# Altium project CANSwitch_V2.PrjPcb
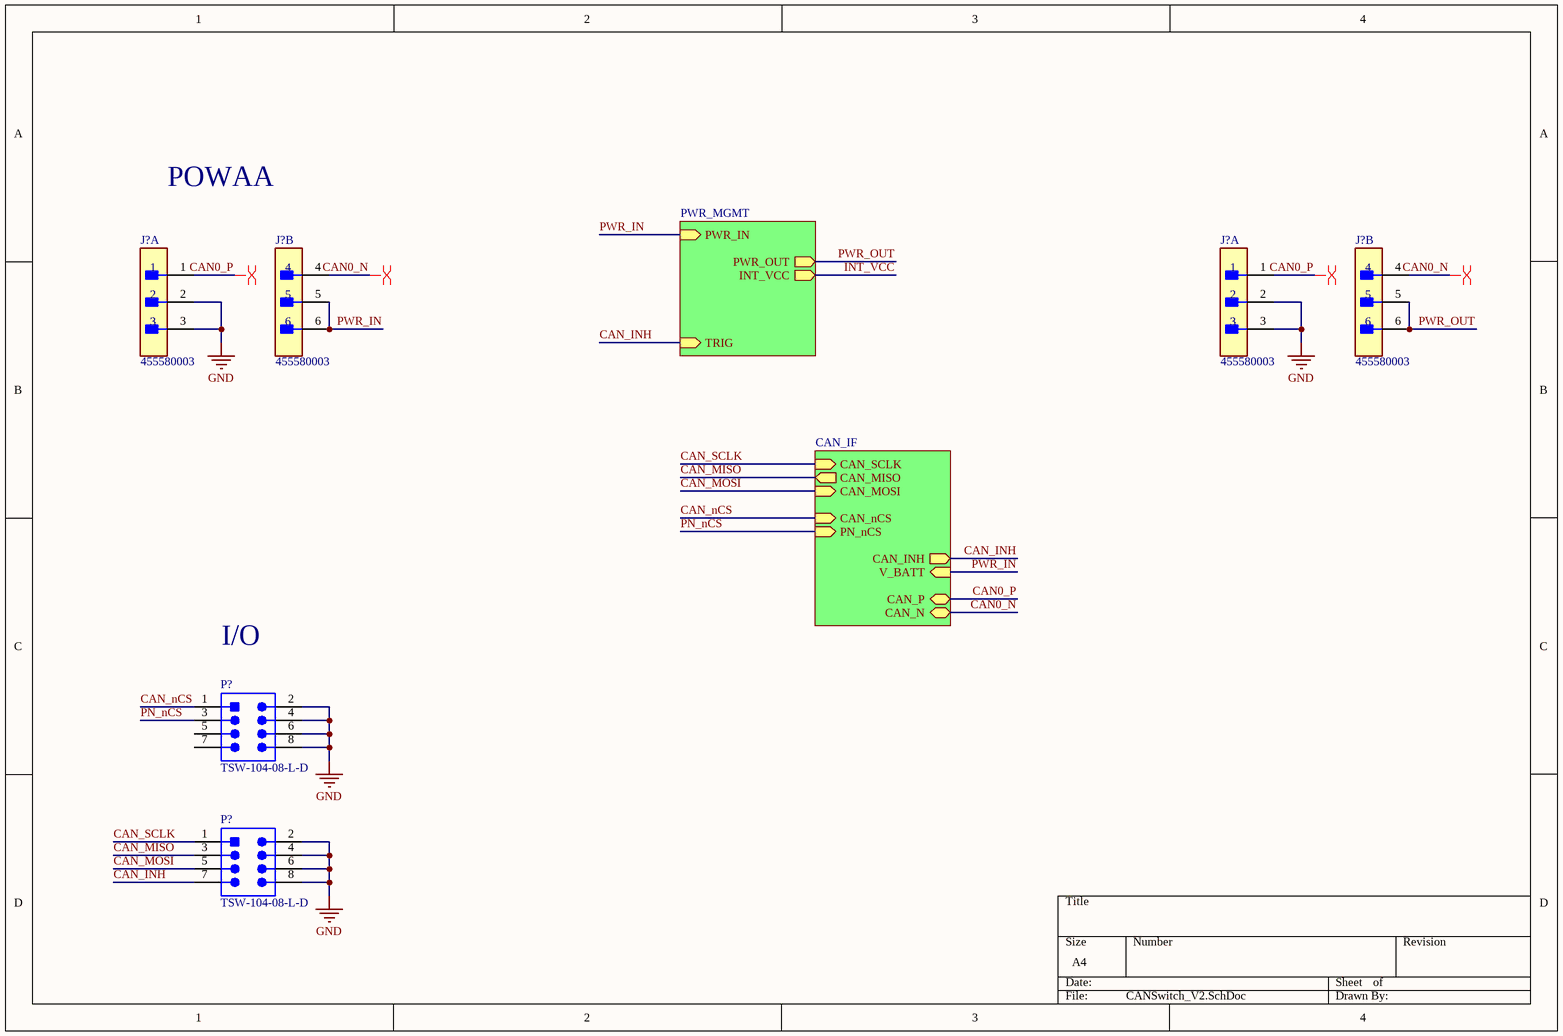
[diagram p0: CANSwitch_V2.SchDoc]
2 sheets, 24 parts. Net scope: hierarchical (ports join the sheet entries above them; power ports are global).
Sheets:
  CANSwitch_V2.SchDoc
    CAN_0 = CAN_IF.SchDoc

## Sheet CANSwitch_V2.SchDoc
size A4; SheetNumber: 1; SheetTotal: 3

### Parts
(Parts that share a designator on the sheet are numbered #1, #2 ... from top to bottom, then left to right.)
J?#1  455580003  [FP-455580003-MFG]  (part A of 2)
J?#2  455580003  [FP-455580003-MFG]  (part B of 2)
J?#3  455580003  [FP-455580003-MFG]  (part A of 2)
J?#4  455580003  [FP-455580003-MFG]  (part B of 2)
P?#1  TSW-104-08-L-D  [SMTC-TSW-104-08-L-D_V]
P?#2  TSW-104-08-L-D  [SMTC-TSW-104-08-L-D_V]

### Sub-sheets
CAN_0 = CAN_IF: CAN_SCLK (in), CAN_MISO (out), CAN_MOSI (in), CAN_nCS (in), CAN_INH (out), V_BATT (in), CAN_P (bidir), CAN_N (bidir), PN_nCS (in)
PWR_MGMT = PWR_MGMT (file not in this document): TRIG (in), PWR_OUT (out), PWR_IN (in), INT_VCC (out)

### Nets
GND: J?#1.2 J?#1.3 J?#3.2 J?#3.3 P?#1.2 P?#1.4 P?#1.6 P?#1.8 P?#2.2 P?#2.4 P?#2.6 P?#2.8
CAN0_N: J?#2.4 J?#4.4 ; sheet CAN_0/CAN_N
CAN0_P: J?#1.1 J?#3.1 ; sheet CAN_0/CAN_P
CAN_INH: P?#2.7 ; sheet CAN_0/CAN_INH, sheet PWR_MGMT/TRIG
CAN_MISO: P?#2.3 ; sheet CAN_0/CAN_MISO
CAN_MOSI: P?#2.5 ; sheet CAN_0/CAN_MOSI
CAN_nCS: P?#1.1 ; sheet CAN_0/CAN_nCS
CAN_SCLK: P?#2.1 ; sheet CAN_0/CAN_SCLK
INT_VCC: sheet PWR_MGMT/INT_VCC
PN_nCS: P?#1.3 ; sheet CAN_0/PN_nCS
PWR_IN: J?#2.5 J?#2.6 ; sheet CAN_0/V_BATT, sheet PWR_MGMT/PWR_IN
PWR_OUT: J?#4.5 J?#4.6 ; sheet PWR_MGMT/PWR_OUT

Not connected (* = marked no-connect by the designer): P?#1 5 7

### Layout directives
differential pair: CAN0_N, CAN0_P

### Notes on the sheet
- POWAA
- I/O

### Library data of the parts
J?#1-J?#4 = CMP-04776-000024-1: CONN HEADER R/A 6POS 4.2MM; Manufacturer: Molex; Standoff Height: 0.4mm; Conn Orientation: Right Angle; Number Of Contacts: 6; Conn Gender: Male; Voltage Rating: 600V; Current Rating: 8A; Footprint Url: https://www.molex.com/pdm_docs/sd/455580003_sd.pdf; Number Of Rows: 2; Lead Free: Yes; Digikey Description: CONN HEADER R/A 6POS 4.2MM; ComponentLink2URL: https://www.molex.com/webdocs/datasheets/pdf/en-us/0455580003_PCB_HEADERS.pdf; Octopart: https://octopart.com/45558-0003-molex-7672845; Package: 0; Device Class L3: unset; ComponentLink2Description: Datasheet; Device Class L2: Headers and Wire Housings; Category: Conn; Contact Material: Tin,Nickel; Mouser Description: Conn Power HDR 6 POS 4.2mm Solder ST Thru-Hole 6 Terminal 1 Port Mini-Fit Jr™ Tray; Manufacturer Part Number: 455580003; Pitch: 4.2mm; Device Class L1: Connectors; Temperature Range Low: -40°C; Temperature: -40°C to +105°C; RoHS: TRUE; Temperature Range High: +105°C; Height: 10.38mm; Automotive: No
P?#1 P?#2 = CMP-1681-00006-4: Male Header, Pitch 2.54 mm, 2 x 4 Position, Height 8.38 mm, Tail Length 5.08 mm, -55 to 125 degC, RoHS, Bulk; Manufacturer: Samtec; Voltage Rating: 550 V; Current Rating: 7.6 A; Rows: 2; ComponentLink2URL: https://datasheet.ciiva.com/25616/0900766b81154476-25616879.pdf; Package Quantity: 1; PackageDescription: Male Header, Pitch 2.54 mm, 2 x 4 Position, Height 8.38 mm, Tail Length 5.08 mm; ComponentLink1Description: Manufacturer URL; Lead Pitch: 0.1 inch; REACH SVHC: No SVHC; Mounting Technology: Through Hole; PackageReference: TSW-104-08-L-D; Contact Plating: Gold; DatasheetVersion: 04/2012; Colour: Black; Contact Finish: Gold; ComponentLink3URL: http://suddendocs.samtec.com/prints/tsw-xxx-xx-x-x-xx-xxx-footprint.pdf; ComponentLink3Description: Package Specification; Mount: Through Hole; RoHSCompliant: true; Packaging: Bulk; ComponentLink2Description: Datasheet; Contact Material: Bronze; Pins: 8; ComponentLink1URL: http://www.samtec.com/

## Sheet CAN_IF.SchDoc
size B; SheetNumber: 2; SheetTotal: 3
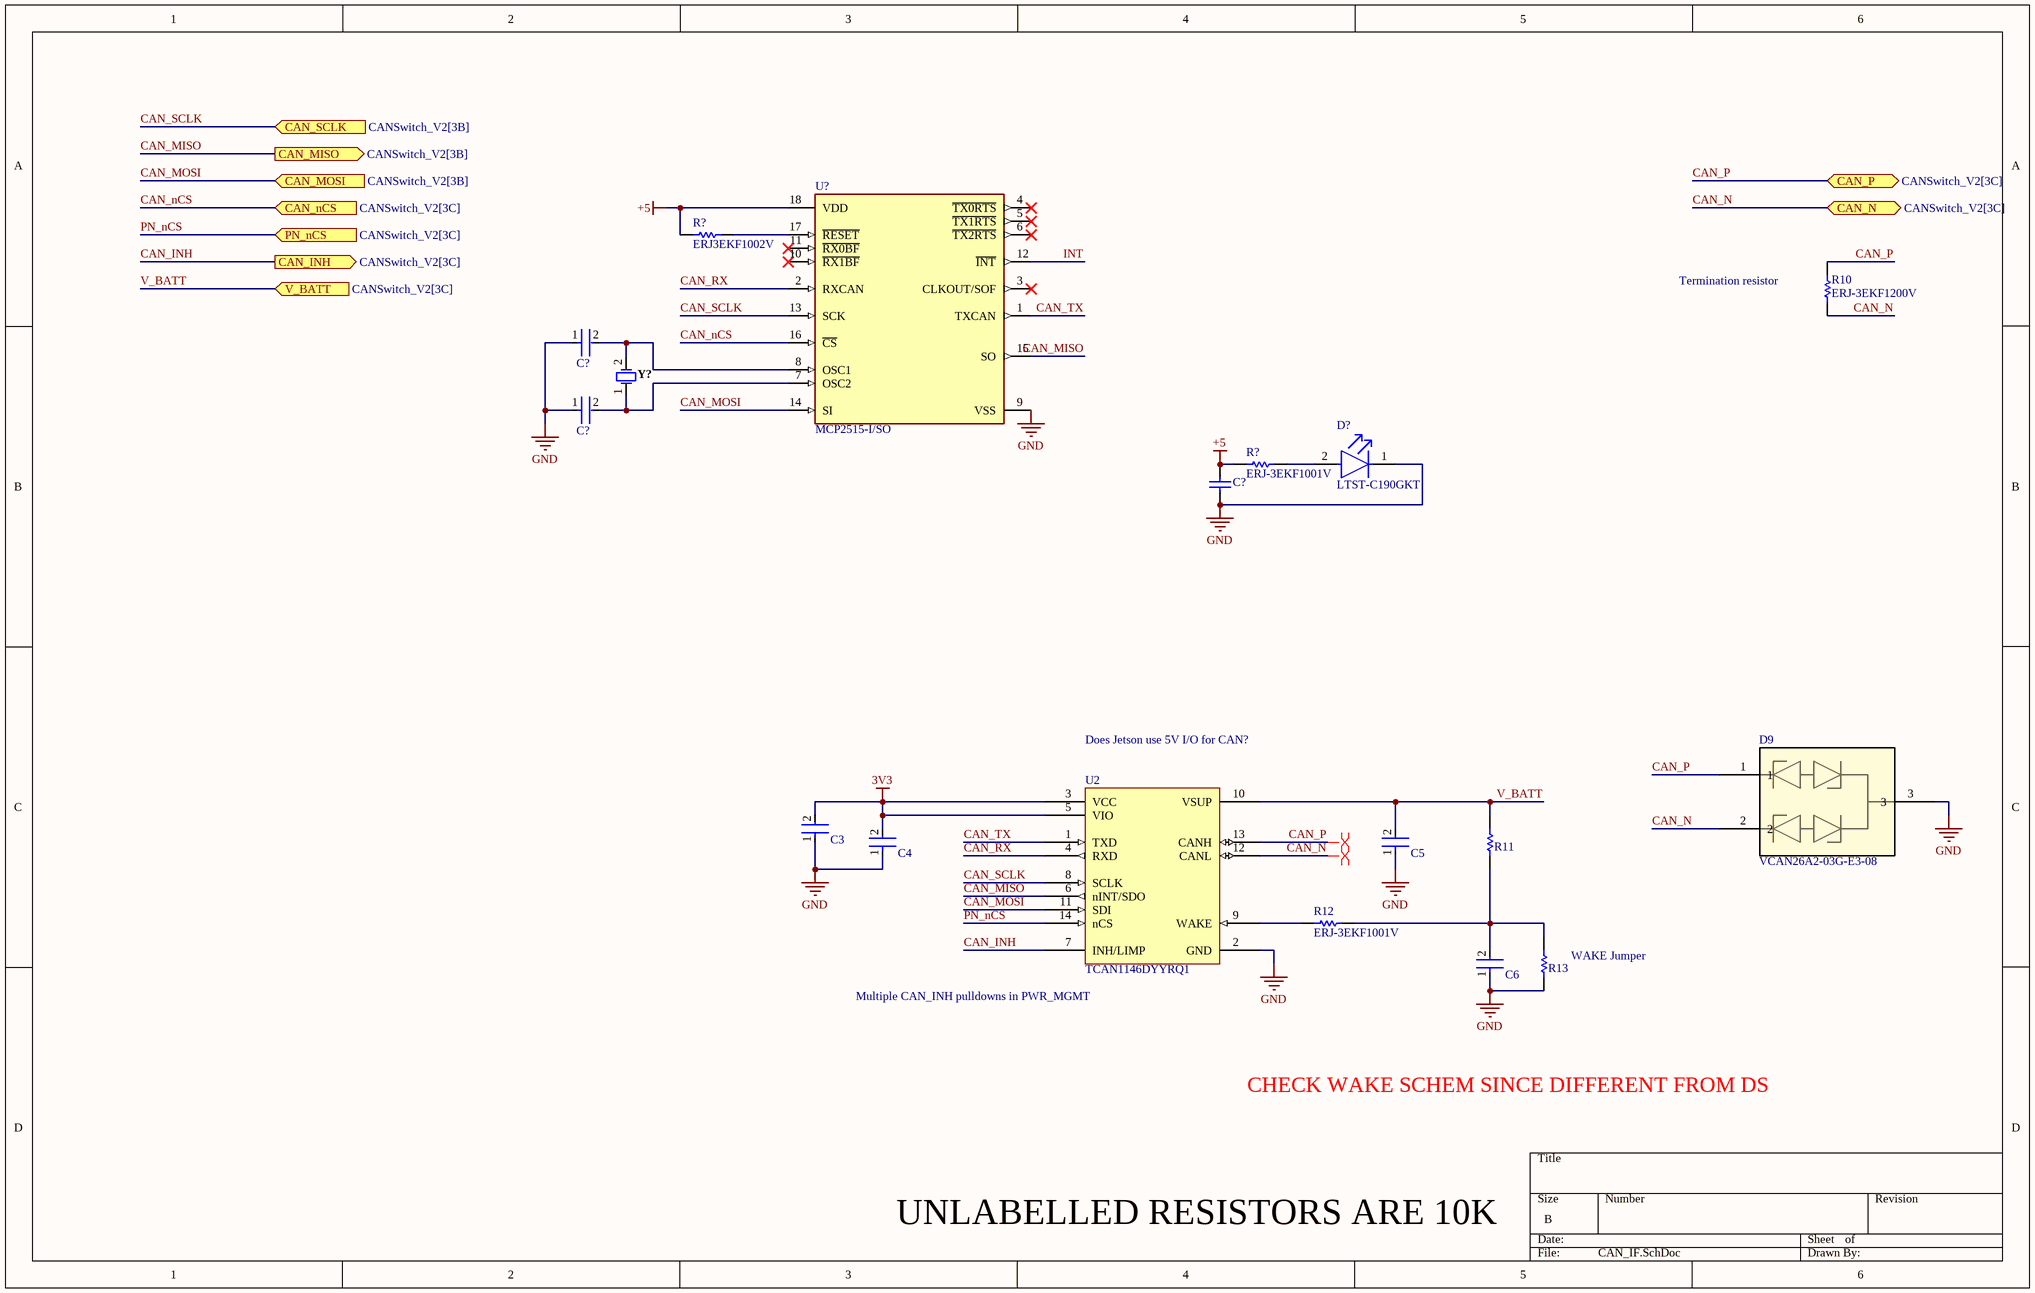
[diagram p1: CAN_IF.SchDoc]

### Parts
(Parts that share a designator on the sheet are numbered #1, #2 ... from top to bottom, then left to right.)
C3  C0402C104K8PACTU  [FP-C0402-BB-MFG]  (value not drawn)
C4  C0402C104K8PACTU  [FP-C0402-BB-MFG]  (value not drawn)
C5  C0402C104K8PACTU  [FP-C0402-BB-MFG]  (value not drawn)
C6  C0402C104K8PACTU  [FP-C0402-BB-MFG]  (value not drawn)
C?#1  GRM188R60J106ME47D  [FP-GRM188-0_1-e0_2_0_55-IPC_A]  (value not drawn)
C?#2  GRM188R60J106ME47D  [FP-GRM188-0_1-e0_2_0_55-IPC_A]  (value not drawn)
C?#3  1206GC102KAT1A  [AVX-1206-2_L]  (value not drawn)
D9  VCAN26A2-03G-E3-08  [VCAN26A2-03G-E3-08-Footprint-1]
D?  LTST-C190GKT  [FP-LTST-C190GKT-MFG]
R10  ERJ-3EKF1200V  [RESC1609X55X30ML15T15]
R11  ERJ3EKF1002V  [RESC1609X55X30LL15T15]  (value not drawn)
R12  ERJ-3EKF1001V  [RESC1608X55X30LL15T15]
R13  0402 JUMPER 0 OHM  [RESC1005X40X25NL05T05]  (value not drawn)
R?#1  ERJ3EKF1002V  [RESC1609X55X30LL15T15]
R?#2  ERJ-3EKF1001V  [RESC1608X55X30LL15T15]
U2  TCAN1146DYYRQ1  [TCAN1146DYYRQ1-Footprint-1]
U?  MCP2515-I/SO  [FP-C04-051-MFG]
Y?  FOXSLF/160-20  [FOX-FOXSLF160-20]  (value not drawn)

### Ports
CAN_INH (out, see CANSwitch_V2[3C]), CAN_MISO (out, see CANSwitch_V2[3B]), CAN_MOSI (in, see CANSwitch_V2[3B]), CAN_N (bidir, see CANSwitch_V2[3C]), CAN_nCS (in, see CANSwitch_V2[3C]), CAN_P (bidir, see CANSwitch_V2[3C]), CAN_SCLK (in, see CANSwitch_V2[3B]), PN_nCS (in, see CANSwitch_V2[3C]), V_BATT (in, see CANSwitch_V2[3C])

### Nets
3V3: C3.2 C4.2 U2.3(VCC) U2.5(VIO)
+5: C?#3.2 R?#1.1 R?#2.2 U?.18(VDD)
GND: C3.1 C4.1 C5.1 C6.1 C?#1.1 C?#2.1 C?#3.1 D9.3 D?.1(C) R13.1 U2.2(GND) U?.9(VSS)
CAN_INH: U2.7(INH/LIMP) ; port CAN_INH
CAN_MISO: U2.6(nINT/SDO) U?.15(SO) ; port CAN_MISO
CAN_MOSI: U2.11(SDI) U?.14(SI) ; port CAN_MOSI
CAN_N: D9.2 R10.1 U2.12(CANL) ; port CAN_N  [project net CAN0_N]
CAN_nCS: U?.16(~{CS}) ; port CAN_nCS
CAN_P: D9.1 R10.2 U2.13(CANH) ; port CAN_P  [project net CAN0_P]
CAN_RX: U2.4(RXD) U?.2(RXCAN)
CAN_SCLK: U2.8(SCLK) U?.13(SCK) ; port CAN_SCLK
CAN_TX: U2.1(TXD) U?.1(TXCAN)
INT: U?.12(~{INT})
PN_nCS: U2.14(nCS) ; port PN_nCS
V_BATT: C5.2 R11.1 U2.10(VSUP) ; port V_BATT  [project net PWR_IN]
NetC6_2: C6.2 R11.2 R12.2 R13.2
NetC?#1_2: C?#1.2 U?.8(OSC1) Y?.2
NetC?#2_2: C?#2.2 U?.7(OSC2) Y?.1
NetD?_2: D?.2(A) R?#2.1
NetR12_1: R12.1 U2.9(WAKE)
NetR?#1_2: R?#1.2 U?.17(~{RESET})

Not connected (* = marked no-connect by the designer): U? 3(CLKOUT/SOF)* 4(~{TX0RTS})* 5(~{TX1RTS})* 6(~{TX2RTS})* 10(~{RX1BF})* 11(~{RX0BF})*

### Layout directives
differential pair: CAN0_N, CAN0_P

### Notes on the sheet
- (near R10) Termination resistor
- Does Jetson use 5V I/O for CAN?
- (near R13) WAKE Jumper
- (near U2) Multiple CAN_INH pulldowns in PWR_MGMT
- CHECK WAKE SCHEM SINCE DIFFERENT FROM DS
- UNLABELLED RESISTORS ARE 10K

### Library data of the parts
C3-C6 = CMP-2008-02046-2: CAP CER 0.1UF 10V X5R 0402; Manufacturer: Kemet; Material: Ceramic; Capacitance: 0.10 μF; Temperature Coefficient: 15%; Tolerance: 0.1; Value: 0.10 μF; Package: C0402-BB; Temperature: -55°C to +125°C; ComponentLink2Description: Datasheet; Temperature Characteristic: X5R; Device Class L1: Passive Components; Height: 0.55mm; Lead Free: Yes; ComponentLink2URL: https://content.kemet.com/datasheets/KEM_C1002_X7R_SMD.pdf; Device Class L2: Capacitors; Temperature Range Low: -55°C; Temperature Range High: +125°C; RoHS: TRUE; Octopart: https://octopart.com/c0402c104k8pactu-kemet-140039; Automotive: No; Mouser Description: Capacitor 100 nF 10 VDC 0402; Category: Cap; Voltage Rating: 10 V; Digikey Description: CAP CER 0.1UF 10V X5R 0402; Ipc Land Pattern Name: CAPC10050X50; Device Class L3: Ceramic Capacitors; Manufacturer Part Number: C0402C104K8PACTU
C?#1 C?#2 = CMP-2006-02792-2: Chip Multilayer Ceramic Capacitors for General Purpose, 0603, 10uF, X5R, 15%, 20%, 6.3V; Packaging: Tape and Reel; Voltage Rating (DC): 6.3V; Width: 0.031inch; Termination: SMD/SMT; Dielectric: X5R; Package Quantity: 4000; Voltage Rating: 6.3V; Capacitance: 10uF; Case/Package: 0603; Min Operating Temperature: -55°C; Voltage: 6.3V; Length: 1.6mm; Thickness: 0.035inch; Lead Free: Lead Free; Depth: 0.8mm; Case Code (Imperial): 0603; Max Operating Temperature: 85°C; Material: Ceramic; Height: 0.8mm; Tolerance: 20%; Mount: Surface Mount; REACH SVHC: No SVHC; Radiation Hardening: No; Case Code (Metric): 1608
C?#3 = CMP-2000-05468-1: Chip Capacitor, 1 nF, +/- 10%, -55 to 125 degC, 1206 (3216 Metric), RoHS, Tape and Reel; Manufacturer: AVX; Capacitance: 0.001uF; Dielectric: X7R; Voltage Rating DC: 2000V; Package Reference: 1206; Datasheet Version: 11/2010; Mounting Technology: SurfaceMount; Manufacturer URL: http://www.avx.com/; Tolerance: 10%; Tolerance (%): ±10%; PartNumber: 1206GC102KAT1A; Datasheet URL: https://datasheet.ciiva.com/11787/0900766b80ed4c37-11787781.pdf; Package Description: 2-Pin SMD, Body 3.4 x 1.8 mm; Case Size/Dimension: 1206; Rated Voltage: 2000V
D9 = CMP-004-00042-1: ESD Suppressor Diode TVS Bi-Dir 26.5V 3-Pin SOT-323 T/R
D? = CMP-22017-000005-2: LED GREEN CLEAR CHIP SMD; Dominant Wavelength: 569nm; Reverse Voltage: 5V; Lens Color: Colorless; Viewing Angle: 130°; Voltage: 2V; Forward Current: 30mA; Power Dissipation: 100mW; Luminous Intensity: 6mcd; Number of LEDs: 1; Forward Voltage: 2.1V; Wavelength: 565nm; Test Current: 10mA; Min Operating Temperature: -55°C; Lens Style: Clear; Mount: Surface Mount; Width: 0.8mm; Packaging: Tape and Reel; Lens Transparency: Clear; Case Code (Metric): 1608; Depth: 0.8mm; Case Code (Imperial): 0603; Case/Package: 0603; Number of Pins: 2; Max Operating Temperature: 85°C; Lead Free: Lead Free; Number of Elements: 1; Length: 1.6mm; Height: 0.8mm; Package Quantity: 1; Power Rating: 100mW; Radiation Hardening: No; Illumination Color: Green; Color: Green
R10 = CMP-2000-00213-2: Chip Resistor, 120 Ohm, +/- 1%, 0.1 W, -55 to 155 degC, 0603 (1608 Metric), RoHS, Tape and Reel; Manufacturer: Panasonic; Power Rating: 100mW; Voltage Rating (DC): 75V; Resistance: 120Ohm; Temperature Coefficient: 100ppm/degreesC; Number of Terminations: 2; Military Standard: Not; Tolerance: 1%; Min Operating Temperature: -55degC; Packaging: TapeandReel; Lead Free: LeadFree; Max Operating Temperature: 155degC; Manufacturer URL: http://www.panasonic.com/; Case Code (Imperial): 0603; REACH SVHC: NoSVHC; Width: 0.031inch; Datasheet URL: https://industrial.panasonic.com/cdbs/www-data/pdf/RDA0000/AOA0000C283.pdf; RoHSCompliant: true; Max Power Dissipation: 100mW; Termination: SMD/SMT; Package Reference: 0603; Height: 0.022inch; Depth: 0.8mm; Package Description: 2-Pin Surface Mount Device, Body 1.6 x 0.85 mm; Contact Plating: Tin; Length: 1.6mm; Package URL: http://www.st.com/st-web-ui/static/active/en/resource/technical/document/datasheet/CD00001320.pdf; Radiation Hardening: No; Package Quantity: 1; Number of Pins: 2; Datasheet Version: 42095.0; Voltage Rating: 75V; Composition: ThickFilm; Case/Package: 0603; Mount: SurfaceMount; Case Code (Metric): 1608
R11 R?#1 = CMP-1012-00623-3: Chip Resistor, 10 KOhm, +/- 1%, 0.1 W, -55 to 155 degC, 0603 (1608 Metric), RoHS, Tape and Reel; Manufacturer: Panasonic; Voltage Rating: 75V; Case\/Package: 0603; Power Rating: 100mW; Resistance: 10KOhm; Temperature Coefficient: 100ppm\/degreesC; Number of Pins: 2; Package Reference: 603; Depth: 0.8mm; Mount: SurfaceMount; Package Description: 2-Pin Surface Mount Device, Body 1.6 x 0.85 mm; Datasheet Version: 02/2017; Length: 1.6mm; Lead Free: LeadFree; Height: 0.45mm; Number of Terminations: 2; Max Power Dissipation: 100mW; Min Operating Temperature: -55degC; Datasheet URL: https://industrial.panasonic.com/cdbs/www-data/pdf/RDA0000/AOA0000C304.pdf; Termination: SMD/SMT; Case Code (Metric): 1608; Case Code (Imperial): 0603; Tolerance: 1%; Max Operating Temperature: 155degC; RoHSCompliant: true; Voltage Rating (DC): 75V; Radiation Hardening: No; Packaging: TapeandReel; Composition: ThickFilm; Mounting Technology: SurfaceMount; Manufacturer URL: http://www.panasonic.com/; Width: 0.031inch; REACH SVHC: NoSVHC; Contact Plating: Tin; Military Standard: Not; Package Quantity: 1
R12 R?#2 = CMP-2000-00180-1: Manufacturer: Panasonic; Part Number: ERJ-3EKF1001V
R13 = CMP-009-00206-2: READ THE NAME
U2 = CMP-015-00012-2: Automotive CAN FD transceiver with watchdog, bus diagnostics and partial networking via sele 14-SOT-23-THIN -40 to 150
U? = CMP-0186-00133-3: IC CAN CONTROLLER W/SPI 18SOIC; Manufacturer: Microchip; Min Supply Voltage: 2.7V; Max Supply Voltage: 5.5V; Standoff Height: 0.1mm; Nominal Supply Current: 10mA; Interface: SPI,CAN; Lead Free: Yes; Digikey Description: IC CAN CONTROLLER W/SPI 18SOIC; Category: IC; RoHS: TRUE; Manufacturer Part Number: MCP2515-I/SO; ComponentLink2URL: http://ww1.microchip.com/downloads/en/DeviceDoc/MCP2515-Stand-Alone-CAN-Controller-with-SPI-20001801J.pdf; Mouser Description: CAN Interface IC W/ SPI Interface; Device Class L2: Interface ICs; Package: C04-051; Automotive: No; Function: Controller; Octopart: https://octopart.com/mcp2515-i%2Fso-microchip-430187; Temperature: -40°C to +85°C; Ipc Land Pattern Name: SOIC127P1030X265-18; Ambient Temperature Range Low: -65°C; Height: 2.65mm; Device Class L1: Integrated Circuits (ICs); Ambient Temperature Range High: +125°C; Footprint Url: http://ww1.microchip.com/downloads/en/DeviceDoc/18L_SOIC_Wide_7.50_SO_C04-0051D.pdf; Temperature Range Low: -40°C; Device Class L3: Controllers; Temperature Range High: +85°C; ComponentLink2Description: Datasheet
Y? = CMP-1749-00003-1: Resistance Weld Thru-Hole Crystal, 16 MHz, -20 to 70 degC, 2-Pin THD, RoHS, Bulk; Voltage Rating: 250 V; Tolerance: 1%; Resistance: 221 kohm; Case\Package: Axial; Power Rating: 250 mW; RoHSCompliant: true; Package Quantity: 200; Packaging: Bulk; Min Operating Temperature: -55 degC; DatasheetVersion: Mar-15; ComponentLink1URL: http://www.foxonline.com/; Max Operating Temperature: 155 degC; PackageReference: FOXSLF160-20; Mount: Through Hole; PackageDescription: 2-Pin Through Hole Device, Body 11.35 x 4.65 mm; ComponentLink1Description: Manufacturer URL; ComponentLink2URL: http://www.foxonline.com/pdfs/hc49slf.pdf; ComponentLink2Description: Datasheet; Length: 0.248 inch

## Nets that join several sheets
GND: CANSwitch_V2 (12 pins), CAN_IF (12 pins)
CAN0_N: CANSwitch_V2 (J?#2.4 J?#4.4), CAN_IF (D9.2 R10.1 U2.12)
CAN0_P: CANSwitch_V2 (J?#1.1 J?#3.1), CAN_IF (D9.1 R10.2 U2.13)
CAN_INH: CANSwitch_V2 (P?#2.7), CAN_IF (U2.7)
CAN_MISO: CANSwitch_V2 (P?#2.3), CAN_IF (U2.6 U?.15)
CAN_MOSI: CANSwitch_V2 (P?#2.5), CAN_IF (U2.11 U?.14)
CAN_nCS: CANSwitch_V2 (P?#1.1), CAN_IF (U?.16)
CAN_SCLK: CANSwitch_V2 (P?#2.1), CAN_IF (U2.8 U?.13)
PN_nCS: CANSwitch_V2 (P?#1.3), CAN_IF (U2.14)
PWR_IN: CANSwitch_V2 (J?#2.5 J?#2.6), CAN_IF (C5.2 R11.1 U2.10)